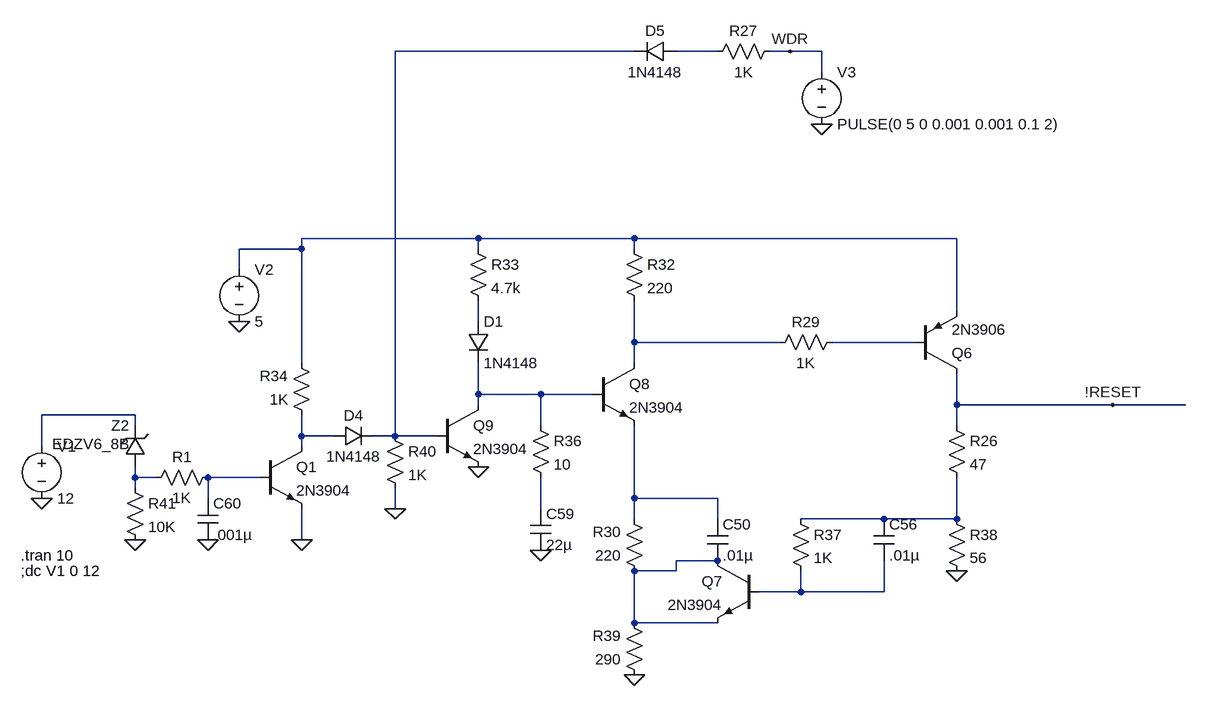
[diagram p0: schematic StarRiderMainCpuWatchDogLtSpice.asc]
StarRiderMainCpuWatchDogLtSpice.asc, the LTspice schematic file:
Version 4
SHEET 1 1860 680
WIRE 1008 -480 640 -480
WIRE 1136 -480 1072 -480
WIRE 1248 -480 1216 -480
WIRE 1296 -480 1248 -480
WIRE 1296 -448 1296 -480
WIRE 768 -192 496 -192
WIRE 1008 -192 768 -192
WIRE 1504 -192 1008 -192
WIRE 496 -176 496 -192
WIRE 496 -176 400 -176
WIRE 768 -176 768 -192
WIRE 1008 -176 1008 -192
WIRE 400 -144 400 -176
WIRE 1504 -80 1504 -192
WIRE 768 -64 768 -96
WIRE 1008 -32 1008 -96
WIRE 1232 -32 1008 -32
WIRE 1440 -32 1312 -32
WIRE 496 0 496 -176
WIRE 1008 0 1008 -32
WIRE 768 48 768 0
WIRE 864 48 768 48
WIRE 944 48 864 48
WIRE 768 64 768 48
WIRE 1504 64 1504 16
WIRE 1744 64 1504 64
WIRE 1856 64 1744 64
WIRE 240 80 96 80
WIRE 240 96 240 80
WIRE 864 96 864 48
WIRE 1504 96 1504 64
WIRE 496 112 496 80
WIRE 544 112 496 112
WIRE 640 112 640 -480
WIRE 640 112 608 112
WIRE 704 112 640 112
WIRE 96 128 96 80
WIRE 496 128 496 112
WIRE 240 176 240 160
WIRE 272 176 240 176
WIRE 432 176 352 176
WIRE 240 192 240 176
WIRE 352 208 352 176
WIRE 1008 208 1008 96
WIRE 1136 208 1008 208
WIRE 640 224 640 192
WIRE 864 224 864 176
WIRE 1008 240 1008 208
WIRE 1136 240 1136 208
WIRE 1392 240 1264 240
WIRE 1504 240 1504 176
WIRE 1504 240 1392 240
WIRE 496 272 496 224
WIRE 1136 304 1072 304
WIRE 1072 320 1072 304
WIRE 1072 320 1008 320
WIRE 1264 352 1264 320
WIRE 1264 352 1200 352
WIRE 1392 352 1392 304
WIRE 1392 352 1264 352
WIRE 1008 400 1008 320
WIRE 1136 400 1008 400
FLAG 240 272 0
FLAG 352 272 0
FLAG 496 272 0
FLAG 640 224 0
FLAG 400 -64 0
FLAG 96 208 0
FLAG 1008 480 0
FLAG 864 288 0
FLAG 768 160 0
FLAG 1504 320 0
FLAG 1296 -368 0
FLAG 1744 64 !RESET
FLAG 1248 -480 WDR
SYMBOL voltage 96 112 R0
SYMATTR InstName V1
SYMATTR Value 12
SYMBOL zener 256 160 R180
WINDOW 0 24 64 Left 2
WINDOW 3 24 36 Left 2
SYMATTR InstName Z2
SYMATTR Value EDZV6_8B
SYMBOL res 224 176 R0
SYMATTR InstName R41
SYMATTR Value 10K
SYMBOL cap 336 208 R0
SYMATTR InstName C60
SYMATTR Value .001µ
SYMBOL res 256 192 R270
WINDOW 0 32 56 VTop 2
WINDOW 3 0 56 VBottom 2
SYMATTR InstName R1
SYMATTR Value 1K
SYMBOL npn 432 128 R0
SYMATTR InstName Q1
SYMATTR Value 2N3904
SYMBOL res 512 96 R180
WINDOW 0 36 76 Left 2
WINDOW 3 36 40 Left 2
SYMATTR InstName R34
SYMATTR Value 1K
SYMBOL diode 544 128 R270
WINDOW 0 32 32 VTop 2
WINDOW 3 0 32 VBottom 2
SYMATTR InstName D4
SYMATTR Value 1N4148
SYMBOL res 624 96 R0
SYMATTR InstName R40
SYMATTR Value 1K
SYMBOL voltage 400 -160 R0
SYMATTR InstName V2
SYMATTR Value 5
SYMBOL npn 704 64 R0
SYMATTR InstName Q9
SYMATTR Value 2N3904
SYMBOL res 1024 336 R180
WINDOW 0 36 76 Left 2
WINDOW 3 36 40 Left 2
SYMATTR InstName R30
SYMATTR Value 220
SYMBOL res 1024 496 R180
WINDOW 0 36 76 Left 2
WINDOW 3 36 40 Left 2
SYMATTR InstName R39
SYMATTR Value 290
SYMBOL cap 1120 240 R0
SYMATTR InstName C50
SYMATTR Value .01µ
SYMBOL npn 1200 304 M0
SYMATTR InstName Q7
SYMATTR Value 2N3904
SYMBOL res 1248 224 R0
SYMATTR InstName R37
SYMATTR Value 1K
SYMBOL res 1488 224 R0
SYMATTR InstName R38
SYMATTR Value 56
SYMBOL cap 1376 240 R0
SYMATTR InstName C56
SYMATTR Value .01µ
SYMBOL res 1488 80 R0
SYMATTR InstName R26
SYMATTR Value 47
SYMBOL res 992 -192 R0
SYMATTR InstName R32
SYMATTR Value 220
SYMBOL res 1328 -48 R90
WINDOW 0 0 56 VBottom 2
WINDOW 3 32 56 VTop 2
SYMATTR InstName R29
SYMATTR Value 1K
SYMBOL res 752 -192 R0
SYMATTR InstName R33
SYMATTR Value 4.7k
SYMBOL diode 752 -64 R0
SYMATTR InstName D1
SYMATTR Value 1N4148
SYMBOL res 848 80 R0
SYMATTR InstName R36
SYMATTR Value 10
SYMBOL cap 848 224 R0
SYMATTR InstName C59
SYMATTR Value 22µ
SYMBOL npn 944 0 R0
SYMATTR InstName Q8
SYMATTR Value 2N3904
SYMBOL pnp 1440 16 M180
SYMATTR InstName Q6
SYMATTR Value 2N3906
SYMBOL voltage 1296 -464 R0
WINDOW 123 0 0 Left 2
WINDOW 39 0 0 Left 2
SYMATTR InstName V3
SYMATTR Value PULSE(0 5 0 0.001 0.001 0.1 2)
SYMBOL res 1232 -496 R90
WINDOW 0 0 56 VBottom 2
WINDOW 3 32 56 VTop 2
SYMATTR InstName R27
SYMATTR Value 1K
SYMBOL diode 1072 -496 R90
WINDOW 0 0 32 VBottom 2
WINDOW 3 32 32 VTop 2
SYMATTR InstName D5
SYMATTR Value 1N4148
TEXT 64 296 Left 2 !.tran 10
TEXT 64 320 Left 2 !;dc V1 0 12

The netlist it stands for:
* StarRiderMainCpuWatchDogLtSpice.asc
V1 N008 0 12
D§Z2 N010 N008 EDZV6_8B
R41 N010 0 10K
C60 N011 0 .001µ
R1 N010 N011 1K
Q1 N009 N011 0 0 2N3904
R34 N009 N003 1K
D4 N009 N001 1N4148
R40 N001 0 1K
V2 N003 0 5
Q9 N007 N001 0 0 2N3904
R30 N015 N012 220
R39 0 N015 290
C50 N012 N015 .01µ
Q7 N015 N016 N015 0 2N3904
R37 N014 N016 1K
R38 N014 0 56
C56 N014 N016 .01µ
R26 !RESET N014 47
R32 N003 N005 220
R29 N006 N005 1K
R33 N003 N004 4.7k
D1 N004 N007 1N4148
R36 N007 N013 10
C59 N013 0 22µ
Q8 N005 N007 N012 0 2N3904
Q6 !RESET N006 N003 0 2N3906
V3 WDR 0 PULSE(0 5 0 0.001 0.001 0.1 2)
R27 WDR N002 1K
D5 N002 N001 1N4148
.model D D
.lib standard.dio
.model NPN NPN
.model PNP PNP
.lib standard.bjt
.tran 10
;dc V1 0 12
.backanno
.end